# Altium schematic sheet mpu-9250.SchDoc
size A4; Organization1: VINCULADA AO EXÉRCITO BRASILEIRO; Organization2: FÁBRICA DE MATERIAL DE; Organization3: COMUNICAÇÕES E ELETRÔNICA; Organization0: INDÚSTRIA DE MATERIAL BÉLICO DO BRASIL
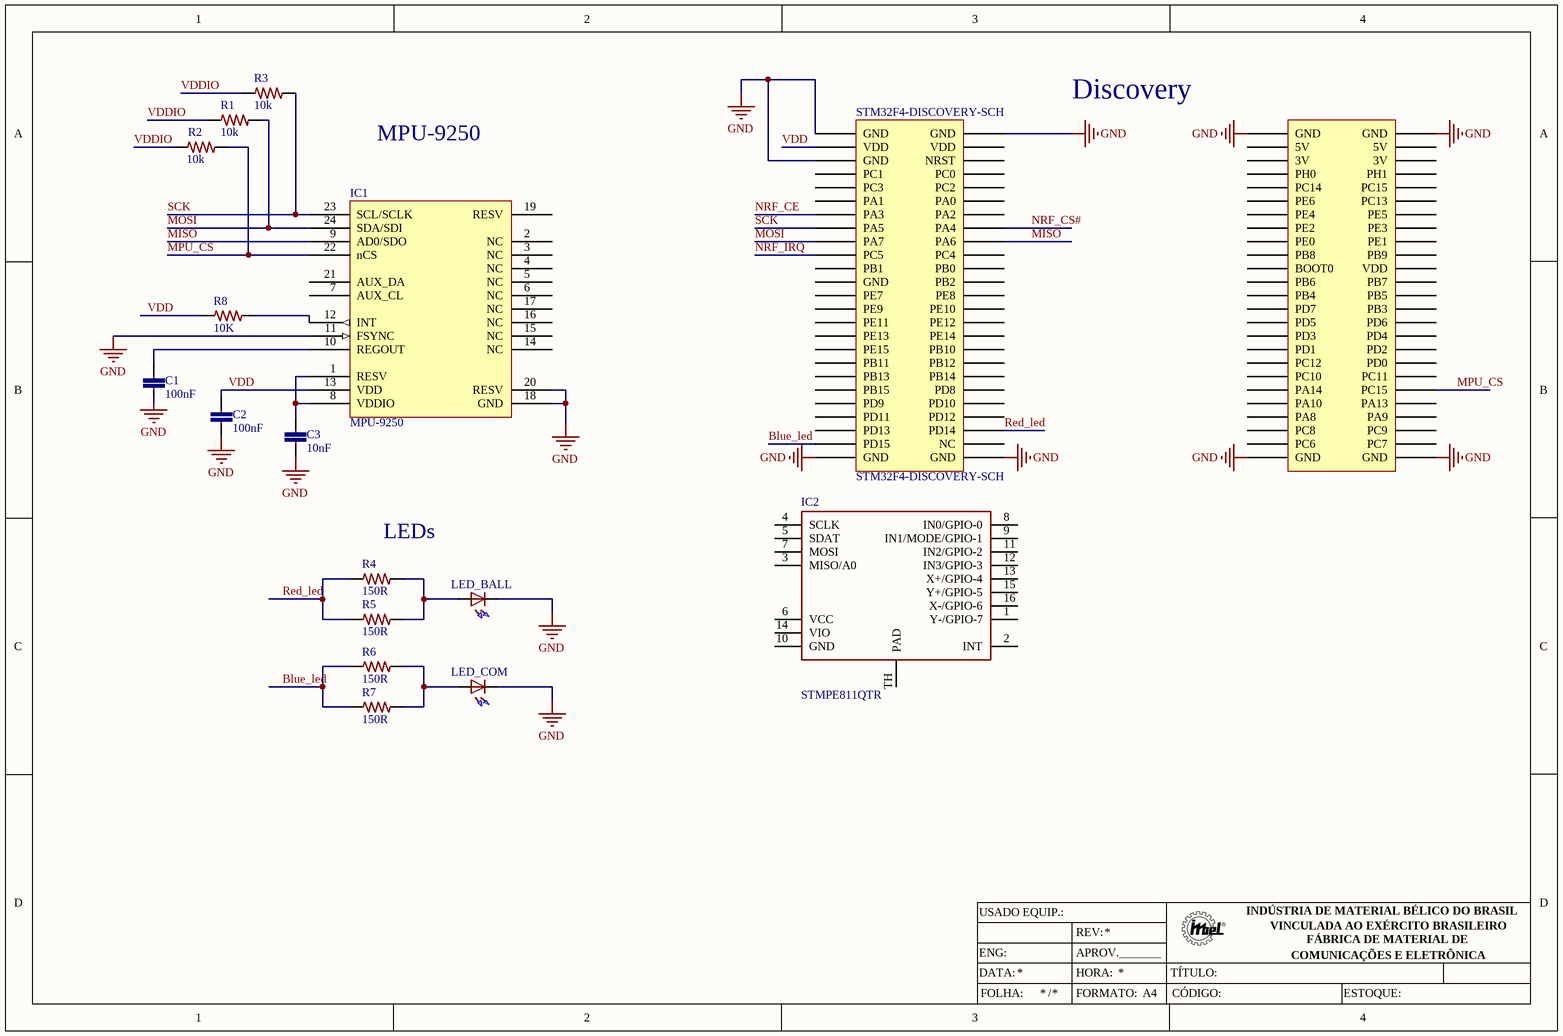
[diagram p0: mpu-9250.SchDoc]

## Parts
C1  100nF  [0402-CAP]
C2  100nF  [0402-CAP]
C3  10nF  [0402-CAP]
IC1  MPU-9250  [MPU-9250]
IC2  STMPE811QTR  [QFN16_N]
LED_BALL  LED  [LED-5MM-PCB]  (value not drawn)
LED_COM  LED  [LED-5MM-PCB]  (value not drawn)
R1  10k  [0201-RES]
R2  10k  [0201-RES]
R3  10k  [0201-RES]
R4  150R  [0201-RES]
R5  150R  [0201-RES]
R6  150R  [0201-RES]
R7  150R  [0201-RES]
R8  10K  [0402-RES-HD]
STM32F4-DISCOVERY-SCH  STM32F4-DISCOVERY-SCH  [STM32F4-DISCOVERY-PCB]

## Nets
GND: C1.2 C2.2 C3.2 IC1.11(FSYNC) IC1.18(GND) IC1.20(RESV) LED_BALL.1(K) LED_COM.1(K) STM32F4-DISCOVERY-SCH.P1_1(GND) STM32F4-DISCOVERY-SCH.P1_2(GND) STM32F4-DISCOVERY-SCH.P1_5(GND) STM32F4-DISCOVERY-SCH.P1_49(GND) STM32F4-DISCOVERY-SCH.P1_50(GND) STM32F4-DISCOVERY-SCH.P2_1(GND) STM32F4-DISCOVERY-SCH.P2_2(GND) STM32F4-DISCOVERY-SCH.P2_49(GND) STM32F4-DISCOVERY-SCH.P2_50(GND)
Blue_led: R6.1 R7.1 STM32F4-DISCOVERY-SCH.P1_47(PD15)
MISO: IC1.9(AD0/SDO) STM32F4-DISCOVERY-SCH.P1_18(PA6)
MOSI: IC1.24(SDA/SDI) R1.2 STM32F4-DISCOVERY-SCH.P1_17(PA7)
MPU_CS: IC1.22(nCS) R2.2 STM32F4-DISCOVERY-SCH.P2_40(PC15)
NRF_CE: STM32F4-DISCOVERY-SCH.P1_13(PA3)
NRF_CS#: STM32F4-DISCOVERY-SCH.P1_16(PA4)
NRF_IRQ: STM32F4-DISCOVERY-SCH.P1_19(PC5)
Red_led: R4.1 R5.1 STM32F4-DISCOVERY-SCH.P1_46(PD14)
SCK: IC1.23(SCL/SCLK) R3.2 STM32F4-DISCOVERY-SCH.P1_15(PA5)
VDD: C2.1 IC1.13(VDD) R8.1 STM32F4-DISCOVERY-SCH.P1_3(VDD)
VDDIO: R1.1 R2.1 R3.1
NetC1_1: C1.1 IC1.10(REGOUT)
NetC3_1: C3.1 IC1.1(RESV) IC1.8(VDDIO)
NetIC1_12: IC1.12(INT) R8.2
NetLED_BALL_2: LED_BALL.2(A) R4.2 R5.2
NetLED_COM_2: LED_COM.2(A) R6.2 R7.2

Not connected (* = marked no-connect by the designer): IC1 2(NC) 3(NC) 4(NC) 5(NC) 6(NC) 7(AUX_CL) 14(NC) 15(NC) 16(NC) 17(NC) 19(RESV) 21(AUX_DA); IC2 1(Y-/GPIO-7) 2(INT) 3(MISO/A0) 4(SCLK) 5(SDAT) 6(VCC) 7(MOSI) 8(IN0/GPIO-0) 9(IN1/MODE/GPIO-1) 10(GND) 11(IN2/GPIO-2) 12(IN3/GPIO-3) 13(X+/GPIO-4) 14(VIO) 15(Y+/GPIO-5) 16(X-/GPIO-6) TH(PAD); STM32F4-DISCOVERY-SCH P1_6(NRST) P1_7(PC1) P1_8(PC0) P1_9(PC3) P1_10(PC2) P1_11(PA1) P1_12(PA0) P1_14(PA2) P1_20(PC4) P1_21(PB1) P1_22(PB0) P1_23(GND) P1_24(PB2) P1_25(PE7) P1_26(PE8) P1_27(PE9) P1_28(PE10) P1_29(PE11) P1_30(PE12) P1_31(PE13) P1_32(PE14) P1_33(PE15) P1_34(PB10) P1_35(PB11) P1_36(PB12) P1_37(PB13) P1_38(PB14) P1_39(PB15) P1_40(PD8) P1_41(PD9) P1_42(PD10) P1_43(PD11) P1_44(PD12) P1_45(PD13) P1_48(NC) P2_3(5V) P2_4(VDD) P2_5(3V) P2_6(3V) P2_7(PH0) P2_8(PH1) P2_9(PC14) P2_10(PC15) P2_11(PE6) P2_12(PC13) P2_13(PE4) P2_14(PE5) P2_15(PE2) P2_16(PE3) P2_17(PE0) P2_18(PE1) P2_19(PB8) P2_20(PB9) P2_21(BOOT0) P2_22(VDD) P2_23(PB6) P2_25(PB4) P2_26(PB5) P2_27(PD7) P2_28(PB3) P2_29(PD5) P2_30(PD6) P2_31(PD3) P2_32(PD4) P2_33(PD1) P2_35(PC12) P2_36(PD0) P2_37(PC10) P2_38(PC11) P2_39(PA14) P2_41(PA10) P2_42(PA13) P2_43(PA8) P2_44(PA9) P2_45(PC8) P2_46(PC9) P2_47(PC6) P2_48(PC7)

## Notes on the sheet
- (near STM32F4-DISCOVERY-SCH) Discovery
- MPU-9250
- (near R4) LEDs
- USADO EQUIP.:
- DATA:
- ENG:
- HORA:
- APROV._______
- REV:
- TÍTULO:
- FOLHA:
- /
- FORMATO:
- A4
- CÓDIGO:
- ESTOQUE:

## Library data of the parts
C1 C2 = CC0402-100nF-A.12: CAP CER 0.1UF 10V 20% X5R 0402; Part No: VJ0402V104ZXQPBC; Cod EMS: 05.281.006.133; Value: 100n
C3 = CC0402-10nF-5: CAP CER 10000PF 25V 5% X7R 0402; Part No: GRM155R71E103JA01J; Cod EMS: 05.281.019.508; Value: 10n
IC1 = MPU-9250-1: IMU ACCEL/GYRO/MAG I2C/SPI 24QFN; Part No: MPU-9250
IC2 = STMPE811QTR-6: IC TSC I/O EXPAND 8B 16QFN; Cod EMS: 05.284.001.511; Part No: STMPE811QTR
LED_BALL LED_COM = LED-5MM-3: LED 5MM PTH
R1-R3 = R0201-10K-1: RES SMD 10K OHM 1% 1/20W 0201; Part No: ERJ-1GEF1002C
R4-R7 = R0201-150R-1: RES SMD 150 OHM 1% 1/10W 0402; Part No: ERJ-2RKF1500X
R8 = R0402-10K-11: RES 10K OHM 1/10W 1% 0402 SMD; Part No: ERJ-2RKF1002X; Cod EMS: 05.280.029.525; Family Description: RESISTOR FILME ESPESSO 10R-1M / 1/10W / 1% / 0402. P/N: ERJ-2RKF....X – PANASONIC ELECTRONIC COMPONENTS.; Value: 10K; Family: ERJ-2RKF....X